# Altium schematic sheet Peripherics.SchDoc
size A4; SheetNumber: 6; SheetTotal: 12
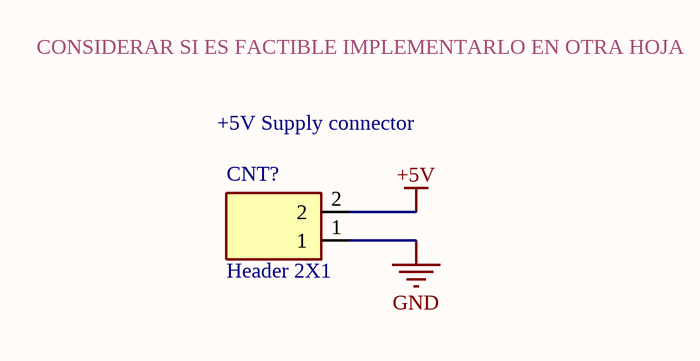
[diagram p0: Peripherics.SchDoc]

## Parts
CNT?  Header 2X1  [Header 2X1]

## Nets
+5V: CNT?.2
GND: CNT?.1

## Notes on the sheet
- CONSIDERAR SI ES FACTIBLE IMPLEMENTARLO EN OTRA HOJA
- (near CNT?) +5V Supply connector

## Library data of the parts
CNT? = Header 2X1: Connector Header Surface Mount 2 position 0.200" (5.08mm); Manufacturer: Samtec; PartNumber: HPM-02-01-T-S; Position2: 2; ComponentLink1Description: DigiKey; ComponentLink1URL: https://www.digikey.com/en/products/detail/samtec-inc/HPM-02-01-T-S/6678234; ComponentLink2Description: ProductPage; ComponentLink2URL: https://www.samtec.com/products/hpm-02-01-t-s-vs